# EAGLE design habanero-32m (EAGLE 6.4)
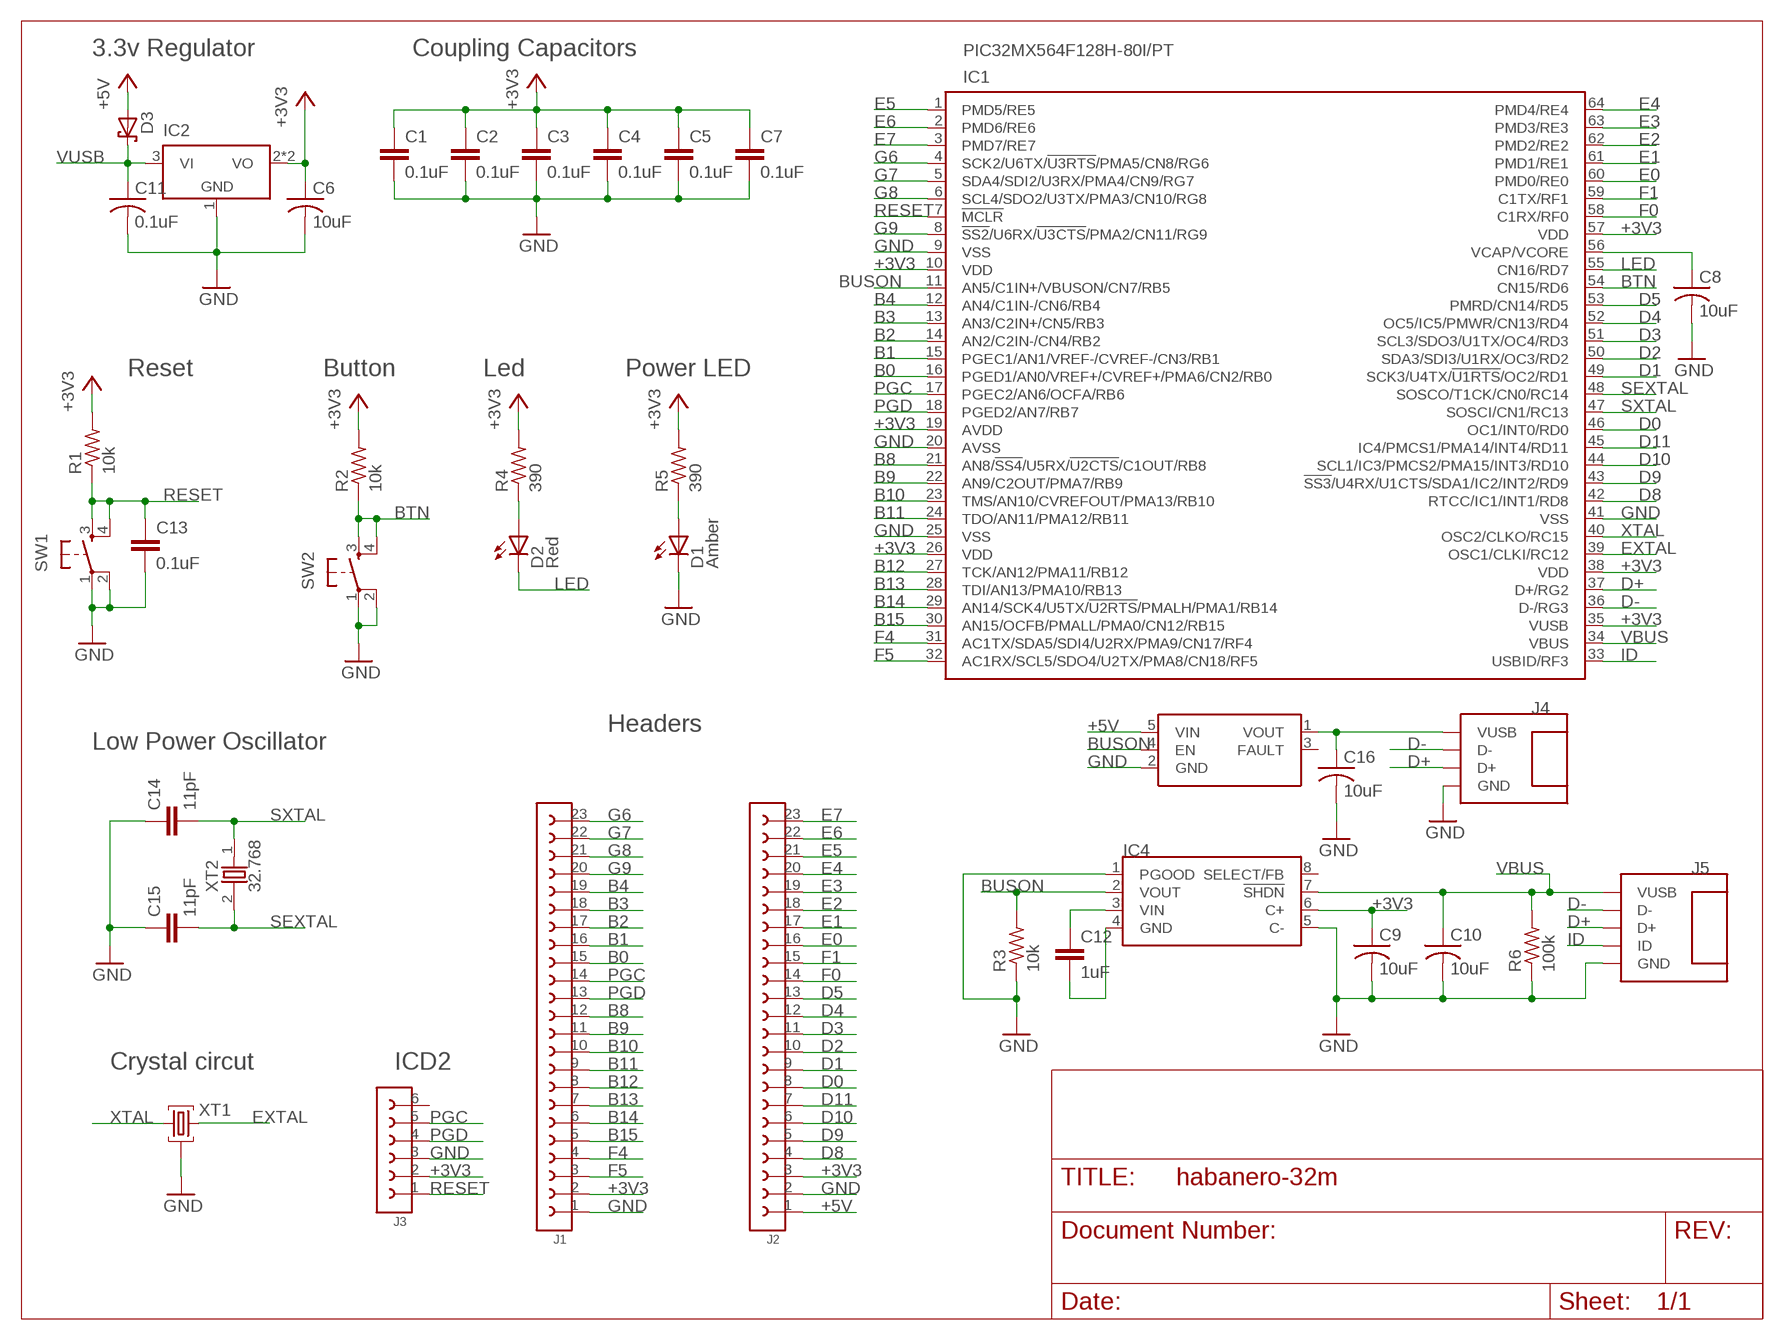
[diagram p0: schematic, sheet 1]

## Parts
C1  0.1uF  C0603C104Z3VAC  [CAPC0603]
C2  0.1uF  C0603C104Z3VAC  [CAPC0603]
C3  0.1uF  C0603C104Z3VAC  [CAPC0603]
C4  0.1uF  C0603C104Z3VAC  [CAPC0603]
C5  0.1uF  C0603C104Z3VAC  [CAPC0603]
C6  10uF  T491A106K016AT  [CAPMP3216-18]
C7  0.1uF  C0603C104Z3VAC  [CAPC0603]
C8  10uF  T491A106K016AT  [CAPMP3216-18]
C9  10uF  T491A106K016AT  [CAPMP3216-18]
C10  10uF  T491A106K016AT  [CAPMP3216-18]
C11  0.1uF  T491A104K050AT  [CAPMP3216-18]
C12  1uF  C0805C105K4RAC  [CAPC0805]
C13  0.1uF  C0603C104Z3VAC  [CAPC0603]
C14  11pF  C0603C110J5GAC  [CAPC0603]
C15  11pF  C0603C110J5GAC  [CAPC0603]
C16  10uF  T491A106K016AT  [CAPMP3216-18]
D1  Amber  SM0805AC  [D0805]
D2  Red  SM0805HC  [D0805]
D3  MBR0530T1G  [SOT123160X270-2N]
IC1  PIC32MX564F128H-80I/PT  [QFP50P1200X1200X100-64N]
IC2  LD1117S33TR  [SOT230P700X180-4N]
IC3  SMTPS2141STR  [SOT95P280X100-5M]
IC4  MCP1253-33X50I/MS  [SOP65P490X109-8M]
J1  61302311121  [PHSP254P5842X254X1154-23S]
J2  61302311121  [PHSP254P5842X254X1154-23S]
J3  61300611121  [PHSP254P1524X254X1154-6S]
J4  292303-1  [USB-A]
J5  1981584-1  [USB-MICRO-B]
R1  10k  CRG0603F10K10  [RESC0603]
R2  10k  CRG0603F10K10  [RESC0603]
R3  10k  CRG0603F10K10  [RESC0603]
R4  390  CRG0603F390R  [RESC0603]
R5  390  CRG0603F390R  [RESC0603]
R6  100k  CRG0603F100K  [RESC0603]
SW1  TL3301NF160QJ  [TACT600X600-4J]
SW2  TL3301NF160QJ  [TACT600X600-4J]
XT1  AWSCR-12.00CR-C  [CERAMIC460X200-3N]
XT2  32.768  ABS07-120-32.768KHZ-T  [CEMIC320X150-2N]

## Nets
+3V3: C1.1 C2.1 C3.1 C4.1 C5.1 C6.1 C7.1 C9.1 IC1.10(VDD) IC1.19(AVDD) IC1.26(VDD) IC1.35(VUSB) IC1.38(VDD) IC1.57(VDD) IC2.2(VO) IC2.4(VO) IC4.6(C+) J1.2 J2.3 J3.2 R1.P$2 R2.P$2 R4.P$2 R5.P$2
+5V: D3.1(A) IC3.5(VIN) J2.1
B0: IC1.16(PGED1/AN0/VREF+/CVREF+/PMA6/CN2/RB0) J1.15
B1: IC1.15(PGEC1/AN1/VREF-/CVREF-/CN3/RB1) J1.16
B2: IC1.14(AN2/C2IN-/CN4/RB2) J1.17
B3: IC1.13(AN3/C2IN+/CN5/RB3) J1.18
B4: IC1.12(AN4/C1IN-/CN6/RB4) J1.19
B8: IC1.21(AN8/!SS4!/U5RX/!U2CTS!/C1OUT/RB8) J1.12
B9: IC1.22(AN9/C2OUT/PMA7/RB9) J1.11
B10: IC1.23(TMS/AN10/CVREFOUT/PMA13/RB10) J1.10
B11: IC1.24(TDO/AN11/PMA12/RB11) J1.9
B12: IC1.27(TCK/AN12/PMA11/RB12) J1.8
B13: IC1.28(TDI/AN13/PMA10/RB13) J1.7
B14: IC1.29(AN14/SCK4/U5TX/!U2RTS!/PMALH/PMA1/RB14) J1.6
B15: IC1.30(AN15/OCFB/PMALL/PMA0/CN12/RB15) J1.5
BTN: IC1.54(CN15/RD6) R2.P$1 SW2.3(S) SW2.4(S1)
BUSON: IC1.11(AN5/C1IN+/VBUSON/CN7/RB5) IC3.4(EN) IC4.2(VOUT) R3.P$2
D0: IC1.46(OC1/INT0/RD0) J2.8
D1: IC1.49(SCK3/U4TX/!U1RTS!/OC2/RD1) J2.9
D2: IC1.50(SDA3/SDI3/U1RX/OC3/RD2) J2.10
D3: IC1.51(SCL3/SDO3/U1TX/OC4/RD3) J2.11
D4: IC1.52(OC5/IC5/PMWR/CN13/RD4) J2.12
D5: IC1.53(PMRD/CN14/RD5) J2.13
D8: IC1.42(RTCC/IC1/INT1/RD8) J2.4
D9: IC1.43(!SS3!/U4RX/U1CTS/SDA1/IC2/INT2/RD9) J2.5
D10: IC1.44(SCL1/IC3/PMCS2/PMA15/INT3/RD10) J2.6
D11: IC1.45(IC4/PMCS1/PMA14/INT4/RD11) J2.7
D+: IC1.37(D+/RG2) J4.2(D+) J5.3(D+)
D-: IC1.36(D-/RG3) J4.3(D-) J5.2(D-)
E0: IC1.60(PMD0/RE0) J2.16
E1: IC1.61(PMD1/RE1) J2.17
E2: IC1.62(PMD2/RE2) J2.18
E3: IC1.63(PMD3/RE3) J2.19
E4: IC1.64(PMD4/RE4) J2.20
E5: IC1.1(PMD5/RE5) J2.21
E6: IC1.2(PMD6/RE6) J2.22
E7: IC1.3(PMD7/RE7) J2.23
EXTAL: IC1.39(OSC1/CLKI/RC12) XT1.3
F0: IC1.58(C1RX/RF0) J2.14
F1: IC1.59(C1TX/RF1) J2.15
F4: IC1.31(AC1TX/SDA5/SDI4/U2RX/PMA9/CN17/RF4) J1.4
F5: IC1.32(AC1RX/SCL5/SDO4/U2TX/PMA8/CN18/RF5) J1.3
G6: IC1.4(SCK2/U6TX/!U3RTS!/PMA5/CN8/RG6) J1.23
G7: IC1.5(SDA4/SDI2/U3RX/PMA4/CN9/RG7) J1.22
G8: IC1.6(SCL4/SDO2/U3TX/PMA3/CN10/RG8) J1.21
G9: IC1.8(!SS2!/U6RX/!U3CTS!/PMA2/CN11/RG9) J1.20
GND: C1.2 C2.2 C3.2 C4.2 C5.2 C6.2 C7.2 C8.2 C9.2 C10.2 C11.2 C13.2 C14.1 C15.1 C16.2 D1.2(C) IC1.9(VSS) IC1.20(AVSS) IC1.25(VSS) IC1.41(VSS) IC2.1(GND) IC3.2(GND) IC4.1(PGOOD) IC4.5(C-) J1.1 J2.2 J3.3 J4.4(GND) J5.5(GND) R3.P$1 R6.P$1 SW1.1(P) SW1.2(P1) SW2.1(P) SW2.2(P1) XT1.2
ID: IC1.33(USBID/RF3) J5.4(ID)
LED: D2.2(C) IC1.55(CN16/RD7)
N$6: C16.1 IC3.1(VOUT) J4.1(VUSB)
N$8: C12.1 IC4.3(VIN)
N$9: D1.1(A) R5.P$1
N$10: D2.1(A) R4.P$1
N$11: C12.2 IC4.4(GND)
N$16: C8.1 IC1.56(VCAP/VCORE)
PGC: IC1.17(PGEC2/AN6/OCFA/RB6) J1.14 J3.5
PGD: IC1.18(PGED2/AN7/RB7) J1.13 J3.4
RESET: C13.1 IC1.7(!MCLR) J3.1 R1.P$1 SW1.3(S) SW1.4(S1)
SEXTAL: C15.2 IC1.48(SOSCO/T1CK/CN0/RC14) XT2.2
SXTAL: C14.2 IC1.47(SOSCI/CN1/RC13) XT2.1
VBUS: C10.1 IC1.34(VBUS) IC4.7(!SHDN) J5.1(VUSB) R6.P$2
VUSB: C11.1 D3.2(C) IC2.3(VI)
XTAL: IC1.40(OSC2/CLKO/RC15) XT1.1
Unconnected: IC3.3(FAULT) IC4.8(SELECT/FB) J3.6

## Notes on the sheet
- 3.3v Regulator | Coupling Capacitors
- Reset | Button | Led | Power LED
- Headers
- Low Power Oscillator
- Crystal circut | ICD2

## Library data of the parts
C1-C5 C7 C13 = kemet-capacitors-ceramic:C?C*VAC: Y5V Dielectric, 6.3 – 50 VDC (Commercial Grade) Description OVERVIEW: KEMET’s Y5V dielectric features an 85°C maximum operating temperature and is considered “general-purpose.” The Electronics Components, Assemblies & Materials Association (EIA) characterizes Z5U dielectric as a Class III material. Components of this classiﬁ cation are ﬁ xed, ceramic dielectric capacitors suited for bypass and decoupling or other applications in which dielectric losses, high insulation resistance and capacitance stability are not of major importance. Y5V exhibits a predictable change in capacitance with respect to time and voltage and displays wide variations in capacitance with reference to ambient temperature. Capacitance change is limited to +22%, -82% from -30°C to +85°C. APPLICATIONS: Typical applications include limited temperature, decoupling and bypass. BENEFITS • -30°C to +85°C operating temperature range • Pb-Free and RoHS Compliant • EIA 0402, 0603, 0805, 1206, and 1210 case sizes • DC voltage ratings of 6.3 V, 10 V, 16 V, 25 V, and 50 V • Capacitance offerings ranging from 0.022 μF to 22 μF • Available capacitance tolerance of +80%/ -20% • Non-polar device, minimizing installation concerns • 100% pure matte tin-plated termination ﬁ nish that allowing for excellent solderability How to Order C 1210 C 226 Z 4 V A C TU Capacitor Class Case Size Specification Series Capacitance Code (pF) Capacitance Tolerance Voltage Dielectric Failure Rate/Design Termination Finish Packaging Grade C = Ceramic 0402 0603 0805 1206 1210 C = Standart 2 signiﬁ cant digits + number of zeros. Use 9 for 1.0 – 9.9 pF Use 8 for 0.5 – .99 pF e.g., 2.2 pF = 229 e.g., 0.5 pF = 508 Z = +80%/-20% 9 = 6.3V 8 = 10V 4 = 16V 3 = 25V 5 = 50 V V = Y5V A = N/A A = 100% Matte Blank = Bulk TU = 7" Reel Unmarked. Ref: Datasheet <http://www.kemet.com/kemet/web/homepage/kechome.nsf/weben/B79D94FAACCDEFCE852579F10063745E/$file/KEM_CC101_COMM_SMD.pdf> Add more variants to C@VAC, just remplace the "@" with a new technologie named according to order code parameters. It is mandatory to fill up the following attributes MANUFACTURER, DESCRIPTION, MOUSER, AVNET, ARROW, FUTURE, NEWARK, DIGIKEY, AVRG-PRICE, OCTOPART-LINK, DATASHEET; AVNET: C0603C104Z3VAC TU; AVRG-PRICE: 0.1; DATASHEET: http://www.kemet.com/kemet/web/homepage/kechome.nsf/weben/B79D94FAACCDEFCE852579F10063745E/$file/KEM_CC101_COMM_SMD.pdf; DESCRIPTION: Capacitores cerámicos de capas múltiples (MLCC) - SMD/SMT0603 25volts 0.1uF Y5V -20+80%; DIGIKEY: 399-1100-2-ND; EAGLEUP: CAPC0603; MANUFACTURER: KEMET; MOUSER: 80-C0603C104Z3V; NEWARK: 31C9013; OCTOPART-LINK: http://octopart.com/c0603c104z3vactu-kemet-98662
C6 C8-C10 C16 = kemet-capacitors-tantalum:T491?*: T491 Industrial Grade MnO2 Series Description OVERVIEW The KEMET T491 Series, designed speciﬁ cally for today’s highly automated surface mount processes and equipment, is the leading choice for surface mount designs. The T491 combines KEMET’s proven solid tantalum technology, acclaimed and respected throughout the world, with the latest in materials, processes and automation, resulting in unsurpassed total performance and value APPLICATIONS Typical applications include decoupling and ﬁ ltering in industrial and automotive end applications such as DC/DC converters, portable electronics, telecommunications, and control units. BENEFITS: • Taped and reeled per EIA 481–1 • Symmetrical, compliant terminations • Optical gold-plated terminations • Laser-marked case • 100% surge current test on C, D, E, U, V, X sizes • Halogen free epoxy • Capacitance 0.1 µF to 1,000 µF • Tolerance ±10%, ±20% • Voltage 2.5 – 50 VDC • Extended range values • Low proﬁ le case sizes • RoHS Compliant and lead-free terminations (See www.kemet.com for transition information) • Operating temperature: -55ºC to +125ºC How to Order T 491 X 157 K 020 A T Capacitor Class Series Case Size Capacitance Code (pF) Capacitance Tolerance Voltage Failure Rate/ Design Lead Material Packaging (C-Spec) T = Tantalum Industrial A, B, C, D, E, R, S, T, U, V, X First two digits represent signiﬁ cant ﬁgures. Third digit speciﬁ es number of zeros. K = ±10% M = ±20% 2R5 = 2.5 V 003 = 3 V 004 = 4 V 006 = 6.3 V 010 = 10 V 016 = 16 V 020 = 20 V 025 = 25 V 035 = 35 V 050 = 50 V A = N/A T = 100% Matte Tin (Sn) Plated* H = Standard Solder Coated (SnPb 5% Pb minimum) G = Gold Plated (A, B, C, D, X only) N = Non-Magnetic 100% Tin (Sn) M = Non-Magnetic (SnPb) Blank = 7" Reel 7280 = 13" Ree Ref: Datasheet <http://www.kemet.com/kemet/web/homepage/kechome.nsf/weben/9F2DE33590D9247E8525788D0059B1E1/$file/KEM_TC101_STD.pdf> Add more variants to T491@, just remplace the "@" with a new technologie named according to order code parameters. It is mandatory to fill up the following attributes MANUFACTURER, DESCRIPTION, MOUSER, AVNET, ARROW, FUTURE, NEWARK, DIGIKEY, AVRG-PRICE, OCTOPART-LINK, DATASHEET; AVRG-PRICE: 0.18; DATASHEET: http://www.kemet.com/kemet/web/homepage/kechome.nsf/weben/9F2DE33590D9247E8525788D0059B1E1/$file/KEM_TC101_STD.pdf; DESCRIPTION: Capacitores de tantalio - SMD sólido 16volt 10uF 10% Lead Free; DIGIKEY: 399-8269-2-ND; EAGLEUP: CAPMP3216-18; MANUFACTURER: KEMET; MOUSER: 80-T491A106K016; OCTOPART-LINK: http://octopart.com/t491a106k016at-kemet-145880
C11 = kemet-capacitors-tantalum:T491?*: T491 Industrial Grade MnO2 Series Description OVERVIEW The KEMET T491 Series, designed speciﬁ cally for today’s highly automated surface mount processes and equipment, is the leading choice for surface mount designs. The T491 combines KEMET’s proven solid tantalum technology, acclaimed and respected throughout the world, with the latest in materials, processes and automation, resulting in unsurpassed total performance and value APPLICATIONS Typical applications include decoupling and ﬁ ltering in industrial and automotive end applications such as DC/DC converters, portable electronics, telecommunications, and control units. BENEFITS: • Taped and reeled per EIA 481–1 • Symmetrical, compliant terminations • Optical gold-plated terminations • Laser-marked case • 100% surge current test on C, D, E, U, V, X sizes • Halogen free epoxy • Capacitance 0.1 µF to 1,000 µF • Tolerance ±10%, ±20% • Voltage 2.5 – 50 VDC • Extended range values • Low proﬁ le case sizes • RoHS Compliant and lead-free terminations (See www.kemet.com for transition information) • Operating temperature: -55ºC to +125ºC How to Order T 491 X 157 K 020 A T Capacitor Class Series Case Size Capacitance Code (pF) Capacitance Tolerance Voltage Failure Rate/ Design Lead Material Packaging (C-Spec) T = Tantalum Industrial A, B, C, D, E, R, S, T, U, V, X First two digits represent signiﬁ cant ﬁgures. Third digit speciﬁ es number of zeros. K = ±10% M = ±20% 2R5 = 2.5 V 003 = 3 V 004 = 4 V 006 = 6.3 V 010 = 10 V 016 = 16 V 020 = 20 V 025 = 25 V 035 = 35 V 050 = 50 V A = N/A T = 100% Matte Tin (Sn) Plated* H = Standard Solder Coated (SnPb 5% Pb minimum) G = Gold Plated (A, B, C, D, X only) N = Non-Magnetic 100% Tin (Sn) M = Non-Magnetic (SnPb) Blank = 7" Reel 7280 = 13" Ree Ref: Datasheet <http://www.kemet.com/kemet/web/homepage/kechome.nsf/weben/9F2DE33590D9247E8525788D0059B1E1/$file/KEM_TC101_STD.pdf> Add more variants to T491@, just remplace the "@" with a new technologie named according to order code parameters. It is mandatory to fill up the following attributes MANUFACTURER, DESCRIPTION, MOUSER, AVNET, ARROW, FUTURE, NEWARK, DIGIKEY, AVRG-PRICE, OCTOPART-LINK, DATASHEET; AVRG-PRICE: 0.23; DATASHEET: http://www.kemet.com/kemet/web/homepage/kechome.nsf/weben/9F2DE33590D9247E8525788D0059B1E1/$file/KEM_TC101_STD.pdf; DESCRIPTION: Capacitores de tantalio - SMD sólido 50V 0.1uF 10% "A"; DIGIKEY: 399-8263-2-ND; EAGLEUP: CAPMP3216-18; MANUFACTURER: KEMET; MOUSER: 80-T491A104K050; NEWARK: 57K1620; OCTOPART-LINK: http://octopart.com/t491a104k050at-kemet-104789
C12 = kemet-capacitors-ceramic:C?C*RAC: X7R Dielectric, 6.3 – 250 VDC (Commercial Grade) Description OVERVIEW: KEMET’s X7R dielectric features a 125°C maximum operating temperature and is considered “temperature stable.” The Electronics Components, Assemblies & Materials Association (EIA) characterizes X7R dielectric as a Class II material. Components of this classiﬁ cation are ﬁ xed, ceramic dielectric capacitors suited for bypass and decoupling applications or for frequency discriminating circuits where Q and stability of capacitance characteristics are not critical. X7R exhibits a predictable change in capacitance with respect to time and voltage and boasts a minimal change in capacitance with reference to ambient temperature. Capacitance change is limited to ±15% from -55°C to +125°C. APPLICATIONS: Typical applications include decoupling, bypass, ﬁ ltering and transient voltage suppression. BENEFITS • -55°C to +125°C operating temperature range • Pb-Free and RoHS Compliant • Temperature stable dielectric • EIA 0402, 0603, 0805, 1206, 1210, 1808, 1812, 1825, 2220, and 2225 case sizes • DC voltage ratings of 6.3 V, 10 V, 16 V, 25 V, 50 V, 100 V, 200 V, and 250 V • Capacitance offerings ranging from 10 pF to 47 μF • Available capacitance tolerances of ±5%, ±10%, and ±20% • Non-polar device, minimizing installation concerns • 100% pure matte tin-plated termination ﬁ nish allowing for excellent solderability • SnPb termination ﬁ nish option available upon request (5% minimum) How to Order C 1206 C 106 M 4 R A C TU Capacitor Class Case Size Specification Series Capacitance Code (pF) Capacitance Tolerance Voltage Dielectric Failure Rate/Design Termination Finish Packaging Grade C = Ceramic 0402 0603 0805 1206 1210 1808 1812 1825 2220 2225 C = Standart 2 signiﬁ cant digits + number of zeros. Use 9 for 1.0 – 9.9 pF Use 8 for 0.5 – .99 pF e.g., 2.2 pF = 229 e.g., 0.5 pF = 508 J = ±5% K = ±10% M = ±20% 9 = 6.3 V 8 = 10 V 4 = 16 V 3 = 25 V 5 = 50 V 1 = 100 V 2 = 200 V A = 250 V R = X7R A = N/A A = 100% Matte Blank = Bulk TU = 7" Reel Unmarked. Ref: Datasheet <http://www.kemet.com/kemet/web/homepage/kechome.nsf/weben/B79D94FAACCDEFCE852579F10063745E/$file/KEM_CC101_COMM_SMD.pdf> Add more variants to C@RAC, just remplace the "@" with a new technologie named according to order code parameters. It is mandatory to fill up the following attributes MANUFACTURER, DESCRIPTION, MOUSER, AVNET, ARROW, FUTURE, NEWARK, DIGIKEY, AVRG-PRICE, OCTOPART-LINK, DATASHEET; EAGLEUP: CAPC0805
C14 C15 = kemet-capacitors-ceramic:C?C*GAC: COG Dielectric, 10 – 200 VDC (Commercial Grade) Description OVERVIEW: KEMET’s C0G dielectric features a 125°C maximum operating temperature and is considered “stable.” The Electronics Components, Assemblies & Materials Association (EIA) characterizes C0G dielectric as a Class I material. Components of this classiﬁ cation are temperature compensating and are suited for resonant circuit applications or those where Q and stability of capacitance characteristics are required. C0G exhibits no change in capacitance with respect to time and voltage and boasts a negligible change in capacitance with reference to ambient temperature. Capacitance change is limited to ±30 ppm/ºC from -55°C to +125°C. BENEFITS • -55°C to +125°C operating temperature range • RoHS Compliant • EIA 0201, 0402, 0603, 0805, 1206, 1210, 1808, 1812, 1825, 2220, and 2225 case sizes • DC voltage ratings of 10 V, 16 V, 25 V, 50 V, 100 V, and 200 V • Capacitance offerings ranging from 0.5 pF up to 0.47 μF • Available capacitance tolerances of ±0.10 pF, ±0.25 pF, ±0.5 pF, ±1%, ±2%, ±5%, ±10%, and ±20% • No piezoelectric noise • Extremely low ESR and ESL • High thermal stability • High ripple current capability • Preferred capacitance solution at line frequencies and into the MHz range • No capacitance change with respect to applied rated DC voltage • Negligible capacitance change with respect to temperature from -55°C to +125°C • No capacitance decay with time • Non-polar device, minimizing installation concerns • 100% pure matte tin-plated termination ﬁ nish allowing for excellent solderability • SnPb plated termination ﬁ nish option available upon request (5% minimum) How to Order C 1206 C 104 J 3 G A C TU Capacitor Class Case Size Specification Series Capacitance Code (pF) Capacitance Tolerance Voltage Dielectric Failure Rate/Design Termination Finish Packaging Grade C = Ceramic 0201 0402 0603 0805 1206 1210 1808 1812 1825 2220 2225 C = Standart 2 signiﬁ cant digits + number of zeros. Use 9 for 1.0 – 9.9 pF Use 8 for 0.5 – .99 pF e.g., 2.2 pF = 229 e.g., 0.5 pF = 508 B = ±0.10 pF C = ±0.25 pF D = ±0.5 pF F = ±1% G = ±2% J = ±5% K = ±10% M = ±20% 8 = 10 V 4 = 16 V 3 = 25 V 5 = 50 V 1 = 100 V 2 = 200 V C = COG A = N/A A = 100% Matte Blank = Bulk TU = 7" Reel Unmarked. Ref: Datasheet <http://www.kemet.com/kemet/web/homepage/kechome.nsf/weben/B79D94FAACCDEFCE852579F10063745E/$file/KEM_CC101_COMM_SMD.pdf> Add more variants to C@GAC, just remplace the "@" with a new technologie named according to order code parameters. It is mandatory to fill up the following attributes MANUFACTURER, DESCRIPTION, MOUSER, AVNET, ARROW, FUTURE, NEWARK, DIGIKEY, AVRG-PRICE, OCTOPART-LINK, DATASHEET; AVRG-PRICE: 0.1; DATASHEET: http://www.kemet.com/kemet/web/homepage/kechome.nsf/weben/B79D94FAACCDEFCE852579F10063745E/$file/KEM_CC101_COMM_SMD.pdf; DESCRIPTION: Capacitores cerámicos de capas múltiples (MLCC) - SMD/SMT 50volts 11pF C0G 5%; DIGIKEY: C0603C110J5GACTU-ND; EAGLEUP: CAPC0603; MANUFACTURER: KEMET; MOUSER: 80-C0603C110J5G; NEWARK: 29T8977; OCTOPART-LINK: http://octopart.com/c0603c110j5gactu-kemet-9138569
D1 = bivar-smleds:SM0805*: Surface Mount LED 0805 Description Bivar Surface Mount 0805 package LED may be used in nearly any lighting or indication application. The miniature package is ideal for small scale applications such as general indication and backlighting. Low power consumption and excellent long life reliability are suitable for battery powered equipment. Bivar offers water clear LED lens for maximum luminous intensity. Wide variety of wavelength and intensity combinations are available to meet any illumination need. The SM0805 LED is packaged in standard tape and reels for pick and place assemblies. ♦ Industry Standard 0805 Package ♦ RoHS Compliant ♦ Small Package and Footprint ♦ Water Clear Lens ♦ Wide Viewing Angle ♦ Ideal for Status Indication, Display, and Backlighting How to Order Type Package Color Clear type Current level SM = Surface mount 0805 A = Amber BW = Blue G = Green H = HE red O = Orange PG = Pure Green R = Read SB = Super Blue SG = Super Green SPG = Super Pure Green SR = Super Red UBW = Ultra Blue UH = Ultra HE Red UO = Ultra Orange UPG = Ultra Pure Green UR = Ultra Red UW = Ultra White UY = Ultra Yellow XPG = Xtra Pure Green Y = Yellow C = Water Clear None = standart L = Low Current Ref: Link <http://www.bivar.com/Products/LEDIndication/LEDs/SurfaceMountLEDs.aspx> Add more variants to SM0805@, just remplace the "@" with a new technologie named according to order code parameters. It is mandatory to fill up the following attributes DESCRIPTION, MOUSER, AVNET, ARROW, FUTURE, NEWARK, DIGIKEY, AVRG-PRICE, OCTOPART-LINK, DATASHEET; AVRG-PRICE: 0.4; DATASHEET: http://www.bivar.com/Images/Cart/SM0805AC.pdf; DESCRIPTION: LED, SMD, 0805, 2 Leads, Amber, Water Clear Lens, 130 Deg Viewing Angle; DIGIKEY: SM0805AC-ND; EAGLEUP: D0805; MOUSER: 749-SM0805AC; NEWARK: 20K3100; OCTOPART-LINK: http://octopart.com/sm0805ac-bivar-5838577
D2 = bivar-smleds:SM0805*: Surface Mount LED 0805 Description Bivar Surface Mount 0805 package LED may be used in nearly any lighting or indication application. The miniature package is ideal for small scale applications such as general indication and backlighting. Low power consumption and excellent long life reliability are suitable for battery powered equipment. Bivar offers water clear LED lens for maximum luminous intensity. Wide variety of wavelength and intensity combinations are available to meet any illumination need. The SM0805 LED is packaged in standard tape and reels for pick and place assemblies. ♦ Industry Standard 0805 Package ♦ RoHS Compliant ♦ Small Package and Footprint ♦ Water Clear Lens ♦ Wide Viewing Angle ♦ Ideal for Status Indication, Display, and Backlighting How to Order Type Package Color Clear type Current level SM = Surface mount 0805 A = Amber BW = Blue G = Green H = HE red O = Orange PG = Pure Green R = Read SB = Super Blue SG = Super Green SPG = Super Pure Green SR = Super Red UBW = Ultra Blue UH = Ultra HE Red UO = Ultra Orange UPG = Ultra Pure Green UR = Ultra Red UW = Ultra White UY = Ultra Yellow XPG = Xtra Pure Green Y = Yellow C = Water Clear None = standart L = Low Current Ref: Link <http://www.bivar.com/Products/LEDIndication/LEDs/SurfaceMountLEDs.aspx> Add more variants to SM0805@, just remplace the "@" with a new technologie named according to order code parameters. It is mandatory to fill up the following attributes DESCRIPTION, MOUSER, AVNET, ARROW, FUTURE, NEWARK, DIGIKEY, AVRG-PRICE, OCTOPART-LINK, DATASHEET; AVRG-PRICE: 0.4; DATASHEET: http://www.bivar.com/images/cart/SM0805HC.pdf; DESCRIPTION: LED estándar - SMD (montaje superficial) HE Red 660 nm Water Clear; DIGIKEY: SM0805HC-ND; EAGLEUP: D0805; MOUSER: 749-SM0805HC; OCTOPART-LINK: http://octopart.com/sm0805hc-bivar-2191580
D3 = on-diodes:MBR0530T*G: SCHOTTKY BARRIER RECTIFIER 0.5 AMPERES 30 VOLTS Description The MBR0530T1/3 uses the Schottky Barrier principle with a large area metal−to−silicon power diode. Ideally suited for low voltage, high frequency rectification or as free wheeling and polarity protection diodes in surface mount applications where compact size and weight are critical to the system. This package also provides an easy to work with alternative to leadless 34 package style. These state−of−the−art devices have the following features: Features  Guardring for Stress Protection  Low Forward Voltage  125C Operating Junction Temperature  Epoxy Meets UL 94, V−0 @ 0.125 in  Package Designed for Optimal Automated Board Assembly  AEC−Q101 Qualified and PPAP Capable  NRVB Prefix for Automotive and Other Applications Requiring Unique Site and Control Change Requirements  All Packages are Pb−Free* How to Order Ref: Datasheet <http://www.mouser.com/ds/2/308/MBR0530T1-D-109532.pdf> Add more variants to MBR0530T@G, just remplace the "@" with a new technologie named according to order code parameters. It is mandatory to fill up the following attributes DESCRIPTION, MOUSER, AVNET, ARROW, FUTURE, NEWARK, DIGIKEY, AVRG-PRICE, OCTOPART-LINK, DATASHEET; EAGLEUP: SOD123
IC1 = mchp_pic32:PIC32MX5*H?: 64 pins, USB and CAN Microcontroller, from 64k to 512k and 32k/128k Ram Description PIC32MX564F064H (64k Flash, 32k Ram) PIC32MX564F128H (128k Flash, 32k Ram) PIC32MX575F256H (256k Flash, 64k Ram) PIC32MX575F512H (512k Flash, 64k Ram) PIC32MX595F512H (512k Flash, 128k Ram) MCU Core -80MHz, 1.56 DMIPS/MHz, 32-bit MIPS M4K® Core -USB 2.0 On-The-Go Peripheral with integrated PHY -10/100 Ethernet MAC with MII/RMII Interfaces -2 x CAN2.0b modules with 1024 buffers -8 Dedicated DMA Channels for USB OTG, Ethernet, and CAN -5 Stage pipeline, Harvard architecture -MIPS16e mode for up to 40% smaller code size -Single cycle multiply and hardware divide unit -32 x 32-bit Core Registers -32 x 32-bit Shadow Registers -Fast context switch and interrupt response MCU System Features -512K Flash (plus 12K boot Flash) -128K RAM (can execute from RAM) -8 Channel General Hardware DMA Controller -Flash prefetch module with 256 Byte cache -Lock instructions or data in cache for fast access -Programmable vector interrupt controller Analog Features -Fast and Accurate 16 channel 10-bit ADC, Max 1 Mega sample per second at +/- 1LSB, conversion available during SLEEP & IDLE -Power Management Modes -RUN, IDLE, and SLEEP modes -Multiple switchable clock modes for each power mode, enables optimum power settings Debug Features -iFlow Trace: Non-intrusive Hardware Instruction Trace port (5 Wires) -8 hardware breakpoints (6 Instruction and 2 Data) -2 wire programming and debugging interface -JTAG interface supporting Programming, Debugging and Boundary scan Other MCU Features -Fail-Safe Clock Monitor - allows safe shutdown if clock fails -2 Internal oscillators (8MHz & 31KHz) -Hardware RTCC (Real-Time Clock and Calendar with Alarms) -Watchdog Timer with separate RC oscillator -Pin compatible with 16-bit PIC® MCUs -Serial Communication Modules allow flexible UART/SPI/I2C™ configuration Device Program Data USB CAN Timers/ Capture/ Compare DMA Channels UART SPI I2C ADC channels Comparators PMP/PSP Jtag Trace PIC32MX564F064H 64 32 1 1 5/5/5 4/4 6 3 4 16 2 Yes Yes No PIC32MX564F128H 128 32 1 1 5/5/5 4/4 6 3 4 16 2 Yes Yes No PIC32MX575F256H 256 64 1 1 5/5/5 8/4 6 3 4 16 2 Yes Yes No PIC32MX575F512H 256 64 1 1 5/5/5 8/4 6 3 4 16 2 Yes Yes No PIC32MX595F512H 512 128 1 1 5/5/5 8/4 6 3 4 16 2 Yes Yes No Ref: Datasheet <http://ww1.microchip.com/downloads/en/DeviceDoc/61156G.pdf>
IC2 = st-ldos:LD1117?*: Low Drop Adjustable Positive Voltage Regulator Description The LD1117 is a low drop voltage regulator able to provide up to 800 mA of output current, available even in adjustable version (VREF= 1.25 V). Concerning fixed versions, are offered the following output voltages: 1.2 V, 1.8 V, 2.5 V, 2.85 V, 3.3 V and 5.0 V. The 2.85 V type is ideal for SCSI-2 lines active termination. The device is supplied in: SOT-223, DPAK, SO-8 and TO-220. The SOT-223 and DPAK surface mount packages optimize the thermal characteristics even offering a relevant space saving effect. High efficiency is assured by NPN pass transistor. In fact in this case, unlike than PNP one, the quiescent current flows mostly into the load. Only a very common 10 μF minimum capacitor is needed for stability. On chip trimming allows the regulator to reach a very tight output voltage tolerance, within ± 1 % at 25 °C. The adjustable LD1117 is pin to pin compatible with the other standard. Adjustable voltage regulators maintaining the better performances in terms of drop and tolerance. KEY FEATURES Low dropout voltage (1 V typ.) 2.85 V device performances are suitable for SCSI-2 active termination Output current up to 800 mA Fixed output voltage of: 1.2 V, 1.8 V, 2.5 V, 3.3 V, 5.0 V Adjustable version availability (VREF= 1.25 V) Internal current and thermal limit Available in ± 1 % (at 25 °C) and 2 % in full temperature range Supply voltage rejection: 75 dB (typ.) How To Order Part Number Package Output Voltaje Temp Range LD1117 S = SOT-223 D = SOIC8 DT = DPACK V = TO220 None = Adjustable 12 = 1.2 volts 18 = 1.8 volts 25 = 2.5 volts 33 = 3.3 volts 50 = 5.0 volts None = 0 to 125 C C = -40 to 125 C Ref: Datasheet <http://www.st.com/internet/com/TECHNICAL_RESOURCES/TECHNICAL_LITERATURE/DATASHEET/CD00000544.pdf> Add more variants to LD1117@, just remplace the "@" with a new technologie named according to order code parameters. It is mandatory to fill up the following attributes MANUFACTURER, DESCRIPTION, MOUSER, AVNET, ARROW, FUTURE, NEWARK, DIGIKEY, AVRG-PRICE, OCTOPART-LINK, DATASHEET; ARROW: LD1117S33TR; AVNET: LD1117S33TR; AVRG-PRICE: 0.76; DATASHEET: http://www.st.com/internet/com/TECHNICAL_RESOURCES/TECHNICAL_LITERATURE/DATASHEET/CD00000544.pdf; DESCRIPTION: Reguladores de interrupción de nivel bajo - LDO 3.3V 0.8A Positive; DIGIKEY: 497-1242-2-ND; EAGLEUP: SOT230P700X180-4N; FUTURE: LD1117S33TR; MANUFACTURER: ST; MOUSER: 511-LD1117S33; NEWARK: 89K0627; OCTOPART-LINK: http://octopart.com/ld1117s33tr-stmicroelectronics-526708
IC3 = st-power-sw:SMTPS21*?TR: Enhanced single channel power switches Description The STMPS2141, STMPS2151, STMPS2161, STMPS2171 power distribution switches are intended for applications where heavy capacitive loads and short circuits are likely to be encountered. These devices incorporate 90 mΩ N-channel MOSFET high-side power switches for power-distribution. These switches are controlled by a logic enable input. KEY FEATURES ■ 90 mΩ high-side MOSFET switch ■ 500/1000 mA continuous current ■ Thermal and short-circuit protection with overcurrent logic output ■ Operating range from 2.7 V to 5.5 V ■ CMOS- and TTL-compatible enable inputs ■ Undervoltage lockout (UVLO) ■ 12 µA maximum standby supply current ■ Ambient temperature range, -40°C to 85°C ■ 8 kV ESD protection ■ Reverse current protection ■ Fault-blanking How To Order Part Number Current Enable Package STMPS21 41 = 500mA 51 = 500mA 61 = 1000mA 71 = 1000mA Active low Active high Active low Active high M = SOIC-8 S= SOT23-5L T = TSSOP8 Ref: Datasheet <http://www.st.com/st-web-ui/static/active/en/resource/technical/document/datasheet/CD00167470.pdf> Add more variants to STMPS21@, just remplace the "@" with a new technologie named according to order code parameters. It is mandatory to fill up the following attributes MANUFACTURER, DESCRIPTION, MOUSER, AVNET, ARROW, FUTURE, NEWARK, DIGIKEY, AVRG-PRICE, OCTOPART-LINK, DATASHEET; EAGLEUP: SOT95P280X100-5N
IC4 = mchp-power:MCP125*?: Low Noise, Positive-Regulated Charge Pump Description The MCP1252/3 are inductorless, positive-regulated charge pump DC/DC converters. The devices generate a regulated fixed (3.3V or 5.0V) or adjustable output voltage. They are specifically designed for applications requiring low noise and high efficiency and are able to deliver up to 120 mA output current. The devices allow the input voltage to be lower or higher than the output voltage, by automatically switching between buck/ boost operation. The MCP1252 has a switching frequency of 650 kHz, avoiding interference with sensitive IF bands. The MCP1253 has a switching frequency of 1 MHz and allows the use of smaller capacitors than the MCP1252, thus saving board space and cost. FEATURES • Inductorless, Buck/Boost, DC/DC Converter • Low Power: 80 µA (Typical) • High Output Voltage Accuracy: - ±2.5% (VOUT Fixed) • 120 mA Output Current • Wide Operating Temperature Range: - -40°C to +85°C • Thermal Shutdown and Short-Circuit Protection • Uses Small Ceramic Capacitors • Switching Frequency: - MCP1252: 650 kHz - MCP1253: 1 MHz • Low Power Shutdown Mode: 0.1 µA (Typical) • Shutdown Input Compatible with 1.8V Logic • VIN Range: 2.0V to 5.5V • Selectable Output Voltage (3.3V or 5.0V) or Adjustable Output Voltage • Space-saving, 8-Lead MSOP • Soft-Start Circuitry to Minimize In-Rush Current How to order Device Operating Frec. Mode Package MCP125 2 = 650 KHz 3 = 1MHz -33x50 = Fixed -ADJ = Adjustable I/MS = micro small outline package Ref: Datasheet <http://www.mouser.com/ds/2/268/21752a-64146.pdf>; EAGLEUP: SOP65P490X109-8M; MANUFACTURER: MICROCHIP
J1 J2 = wurth-pin-socket-headers:6130231?: (23) 2.54mm Pin Header Description MATERIAL INSULATOR: PBT FLAMABILITY RATING: UL94-V0 COLOR: BLACK CONTACT MATERIAL: COPPER ALLOY CONTACT TYPE: STAMPED CONTACT PLATING: GOLD QUALITY CLASS: 3 AS PER CECC 75 301-802 PITCH: 2.54MM ENVIRONMENTAL OPERATING TEMPERATURE: -40 UP TO 125°C COMPLIANCE: LEAD FREE AND ROHS ELECTRICAL CURRENT RATING: 3A WORKING VOLTAGE: 250V AC INSULATOR RESISTANCE: >1000 MOHM DIELECTRIC WITHSTANDING VOLTAGE: 500V AC/MN CONTACT RESISTANCE: 20 mOHM MAX DIMENSION B = 2.54 x NB POSITIONS How to order Type Header/Socket Number of Positions Variation 613 = 2.54mm Pitch from 1 to 40 1121 = Pin Header Straigh Post 1021 = Pin Header Right Angle 1821 = Socket Header Straigh Post 43121 = Socket Header Right Angle Ref: Datasheet <http://katalog.we-online.de/em/datasheet/6130xx11121.pdf> , Datasheet <http://katalog.we-online.de/em/datasheet/6130xx11021.pdf> , Datasheet <http://katalog.we-online.de/em/datasheet/6130xx11821.pdf> , Datasheet <http://katalog.we-online.de/em/datasheet/6130xx143121.pdf>
J3 = wurth-pin-socket-headers:6130061?: (6) 2.54mm Pin Header Description MATERIAL INSULATOR: PBT FLAMABILITY RATING: UL94-V0 COLOR: BLACK CONTACT MATERIAL: COPPER ALLOY CONTACT TYPE: STAMPED CONTACT PLATING: GOLD QUALITY CLASS: 3 AS PER CECC 75 301-802 PITCH: 2.54MM ENVIRONMENTAL OPERATING TEMPERATURE: -40 UP TO 125°C COMPLIANCE: LEAD FREE AND ROHS ELECTRICAL CURRENT RATING: 3A WORKING VOLTAGE: 250V AC INSULATOR RESISTANCE: >1000 MOHM DIELECTRIC WITHSTANDING VOLTAGE: 500V AC/MN CONTACT RESISTANCE: 20 mOHM MAX DIMENSION B = 2.54 x NB POSITIONS How to order Type Header/Socket Number of Positions Variation 613 = 2.54mm Pitch from 1 to 40 1121 = Pin Header Straigh Post 1021 = Pin Header Right Angle 1821 = Socket Header Straigh Post 43121 = Socket Header Right Angle Ref: Datasheet <http://katalog.we-online.de/em/datasheet/6130xx11121.pdf> , Datasheet <http://katalog.we-online.de/em/datasheet/6130xx11021.pdf> , Datasheet <http://katalog.we-online.de/em/datasheet/6130xx11821.pdf> , Datasheet <http://katalog.we-online.de/em/datasheet/6130xx143121.pdf>; AVRG-PRICE: 0.41; DATASHEET: http://www.mouser.com/ds/2/445/6130xx11121-48870.pdf; DESCRIPTION: pin header straight post 2.54"; EAGLEUP: PHSP254P1524X254X1154-6S; MANUFACTURER: WURTH; MOUSER: 710-61300611121; OCTOPART-LINK: http://octopart.com/61300611121-w%C3%BCrth+elektronik+midcom-20084590
J4 = te-usb:292303-?*: USB A R/A RCPT Description Product Type Features: Size = Standard Series = A Gender = Receptacle Orientation = Right Angle LED = Without PCB Mount Retention Type = Kinked Leg(s) Mechanical Attachment: Mount Location = Top Termination Features: Contact Termination Type = Through Hole Termination Method = Solder Tail Length (mm [in]) = 2.84 [0.112] Dimensions: PCB Thickness, Recommended (mm [in]) = 1.57 [0.062] How to order Common Part Type = Caractericitcs 292303 -1 = Solder tail length 2.84 mm/Kinked legs -2 = Solder tail length 2.29 mm/Kinked legs -4 = Solder tail length 2.84 mm/Kinked legs/High temperature compatible -5 = Solder tail length 2.84 mm/Kinked legs -6 = Solder tail length 2.29 mm/Kinked legs/High temperature compatible -7 = T/H solder legs -9 = High temperature surface mount hold down tab Ref: Datasheet <http://www.te.com/commerce/DocumentDelivery/DDEController?Action=showdoc&DocId=Customer+Drawing%7F292303%7FE8%7Fpdf%7FEnglish%7FENG_CD_292303_E8.pdf%7F292303-1>; EAGLEUP: USB-A-TH+TH
J5 = te-usb:1981584-1: MICRO USB RECEPTACLE STANDARD TYPE AB ASSY Description Product Type Features: Size = Micro Series = AB Gender = Receptacle Orientation = Right Angle LED = Without PCB Mount Retention Type = SMT Hold Down Mechanical Attachment: Mount Location = Top Termination Features: Contact Termination Type = Surface Mount Termination Method = Surface Mount Dimensions: PCB Thickness, Recommended (mm [in]) = 1.00 [0.039] How to order Ref: Datasheet <http://www.te.com/commerce/DocumentDelivery/DDEController?Action=showdoc&DocId=Customer+Drawing%7F1981584%7FD1%7Fpdf%7FEnglish%7FENG_CD_1981584_D1.pdf%7F1981584-1>; EAGLEUP: TE_USB-MICRO-AB-4T
R1-R3 = te-fixed-resistors:CRG?*: Thick Film Chip Resistors 1% and 5% tolerance Description Precious metal terminations are screen printed onto a ceramic base and fired. The resistive element is screen printed and fired and the passivation layer added. Each resistor is trimmed to tolerance by laser. The pre-scribed tile is broken into strips, the end plating is fired on and the strips broken into individual components. Final termination is made by electroplating. Key Features Thick film resistors with a high power to size ratio,ideally suited to industrial and general purpose use. A range from 1 ohm to 10M and tolerances of 1% and 5%. Also including zero ohm links. Suitable for most applications, including high frequency operation, owing to the short lead structure and low capacitance. Seven Package Sizes Terminal finish: Matte Sn MSL Level 2 How to order Common Part Size Tolerance Resistance Value CRG - Thick Film Chip Resistor 0201 0402 0603 0805 1206 2512 F - ±1% J - ±5% 1 ohm (1 ohm) 1R0 1K ohm (1000 ohms) 1K 100K ohm (100000 ohms) 100K 1M ohm (1000000 ohms) 1M Ref: Datasheet <http://www.te.com/commerce/DocumentDelivery/DDEController?Action=showdoc&DocId=Data+Sheet%7F1773204%7FH%7Fpdf%7FEnglish%7FENG_DS_1773204_H.pdf%7F1623095-1>; AVRG-PRICE: 0.1; DATASHEET: http://www.te.com/commerce/DocumentDelivery/DDEController?Action=showdoc&DocId=Data+Sheet%7F1773204%7FH%7Fpdf%7FEnglish%7FENG_DS_1773204_H.pdf%7F1623095-1; DESCRIPTION: Resistores de película gruesa - SMD CRG0603 1% 10K 10KRL; EAGLEUP: RESC0603; MOUSER: 279-CRG0603F10K/10; OCTOPART-LINK: http://octopart.com/crg0603f10k10-tyco+electronics-16077289
R4 R5 = te-fixed-resistors:CRG?*: Thick Film Chip Resistors 1% and 5% tolerance Description Precious metal terminations are screen printed onto a ceramic base and fired. The resistive element is screen printed and fired and the passivation layer added. Each resistor is trimmed to tolerance by laser. The pre-scribed tile is broken into strips, the end plating is fired on and the strips broken into individual components. Final termination is made by electroplating. Key Features Thick film resistors with a high power to size ratio,ideally suited to industrial and general purpose use. A range from 1 ohm to 10M and tolerances of 1% and 5%. Also including zero ohm links. Suitable for most applications, including high frequency operation, owing to the short lead structure and low capacitance. Seven Package Sizes Terminal finish: Matte Sn MSL Level 2 How to order Common Part Size Tolerance Resistance Value CRG - Thick Film Chip Resistor 0201 0402 0603 0805 1206 2512 F - ±1% J - ±5% 1 ohm (1 ohm) 1R0 1K ohm (1000 ohms) 1K 100K ohm (100000 ohms) 100K 1M ohm (1000000 ohms) 1M Ref: Datasheet <http://www.te.com/commerce/DocumentDelivery/DDEController?Action=showdoc&DocId=Data+Sheet%7F1773204%7FH%7Fpdf%7FEnglish%7FENG_DS_1773204_H.pdf%7F1623095-1>; AVRG-PRICE: 0.1; DATASHEET: http://www.te.com/commerce/DocumentDelivery/DDEController?Action=showdoc&DocId=Data+Sheet%7F1773204%7FH%7Fpdf%7FEnglish%7FENG_DS_1773204_H.pdf%7F1623095-1; DESCRIPTION: Resistores de película gruesa - SMD 0603 390Ohms 1/10W 50V; EAGLEUP: RESC0603; MOUSER: 279-CRG0603F390R; OCTOPART-LINK: http://octopart.com/crg0603f390r-tyco+electronics-16077369
R6 = te-fixed-resistors:CRG?*: Thick Film Chip Resistors 1% and 5% tolerance Description Precious metal terminations are screen printed onto a ceramic base and fired. The resistive element is screen printed and fired and the passivation layer added. Each resistor is trimmed to tolerance by laser. The pre-scribed tile is broken into strips, the end plating is fired on and the strips broken into individual components. Final termination is made by electroplating. Key Features Thick film resistors with a high power to size ratio,ideally suited to industrial and general purpose use. A range from 1 ohm to 10M and tolerances of 1% and 5%. Also including zero ohm links. Suitable for most applications, including high frequency operation, owing to the short lead structure and low capacitance. Seven Package Sizes Terminal finish: Matte Sn MSL Level 2 How to order Common Part Size Tolerance Resistance Value CRG - Thick Film Chip Resistor 0201 0402 0603 0805 1206 2512 F - ±1% J - ±5% 1 ohm (1 ohm) 1R0 1K ohm (1000 ohms) 1K 100K ohm (100000 ohms) 100K 1M ohm (1000000 ohms) 1M Ref: Datasheet <http://www.te.com/commerce/DocumentDelivery/DDEController?Action=showdoc&DocId=Data+Sheet%7F1773204%7FH%7Fpdf%7FEnglish%7FENG_DS_1773204_H.pdf%7F1623095-1>; EAGLEUP: RESC0603
SW1 SW2 = esw-tactile-sw:TL3301?*J: 6mm x 6mm Push Button, J lead Description Designed for SMT applications, each model has different features ranging from low profile designs, normally opened, right angle, and dual action. Applications include telecommunications, consumer electronics, audio/visual, medical devices, testing/instrumentation and computer/peripherals. SPECIFICATIONS: RATING: 50mA 12VDC MECHANICAL LIFE: ≥100,000 Cycles CONTACT RESISTANCE: 100mΩ Max. INSULATION RESISTANCE: 100MΩ Min. DIELECTRIC STRENGTH: 250VAC ACTUATION FORCE: 100gf ± 50gf; 160gf± 50gf; 260gf ± 50gf How to order Series Model Actuator Operating Force Contact Material Termination TL 3301 N = 4.3mm A = 5.0mm E = 7.3mm F = 7.0mm C = 8.0mm P = 8.5mm B = 9.5mm D =13.0mm F100 F160 F260 R - Gold Q - Silver J - J-lead Ref: Datasheet <http://www.e-switch.com/Portals/0/Series_Pdf/TL3301.pdf> Add more variants to TL3301@J, just remplace the "@" with a new technologie named according to order code parameters. It is mandatory to fill up the following attributes MANUFACTURER, DESCRIPTION, MOUSER, AVNET, ARROW, FUTURE, NEWARK, DIGIKEY, AVRG-PRICE, OCTOPART-LINK, DATASHEET; AVRG-PRICE: 0.41; DATASHEET: http://www.e-switch.com/Portals/0/Series_Pdf/TL3301.pdf; DESCRIPTION: Interruptores táctiles SMT Tact Switch SPST-NO 0.05A 12V J; DIGIKEY: EG4376TR-ND; EAGLEUP: TACT600X600X430-4J; MANUFACTURER: E-SWITCH; MOUSER: 612-TL3301NF160QJ; NEWARK: 15N4501; OCTOPART-LINK: http://octopart.com/tl3301nf160qj-e-switch-1252925
XT1 = abracon-resonators:AWSCR-*CR-C: 4.5 x 2.0 x 1.2 mm INDUSTRIAL GRADE BUILT-IN CAPACITANCE CERAMIC RESONATOR Description FEATURES: • Low resonant impedance • Built-in load capacitors • IR reflow capable APPLICATIONS: • Remote controls, Microprocessor clocks, DVD & CD-ROMs, Electric appliances • Consumer electronics How to Order Cristal Frequency in MHz Load Capacitance Packaging AWSCR 12.00CR-C Contact ABRACON for Built-in Capacitance options Blank: Bulk T: Tape & Reel Ref: Datasheet <http://www.abracon.com/Resonators/AWSCR_MGD.pdf> Add more variants to AWSCR@, just remplace the "@" with a new technologie named according to order code parameters. It is mandatory to fill it up the following attributes MANUFACTURER, DESCRIPTION, MOUSER, AVNET, ARROW, FUTURE, NEWARK, DIGIKEY, AVRG-PRICE, OCTOPART-LINK, DATASHEET; MANUFACTURER: ABRACON
XT2 = abracon-crystals:ABS07-120-32.768KHZ-T: 3.2 x 1.5 x 0.9mm • Low Profile, 32.768kHz 6pF, ESR Optimized Tuning Fork Crystal Description FEATURES: • Guaranteed ESR of 60kΩ Maximum for Low Power Designs • 0.9mm height ideal for high density circuit boards • Seam sealed ceramic package offers excellent environmental & heat resistance • Extended Operating temperature of -40°C to +85°C for industrial applications APPLICATIONS: • Power sensitive designs requiring Low ESR Crystal • Communication & measurement equipment • Commercial, Consumer & Industrial applications • Wireless communications • PDA and Smartphone How to Order ABS07-120-32.768kHz-T Ref: Datasheet <http://www.abracon.com/Resonators/ABS07-120-32.768kHz-T.pdf> It is mandatory to fill it up the following attributes MANUFACTURER, DESCRIPTION, MOUSER, AVNET, ARROW, FUTURE, NEWARK, DIGIKEY, AVRG-PRICE, OCTOPART-LINK, DATASHEET; EAGLEUP: CEMIC320X150-2N; MANUFACTURER: ABRACON

## Board
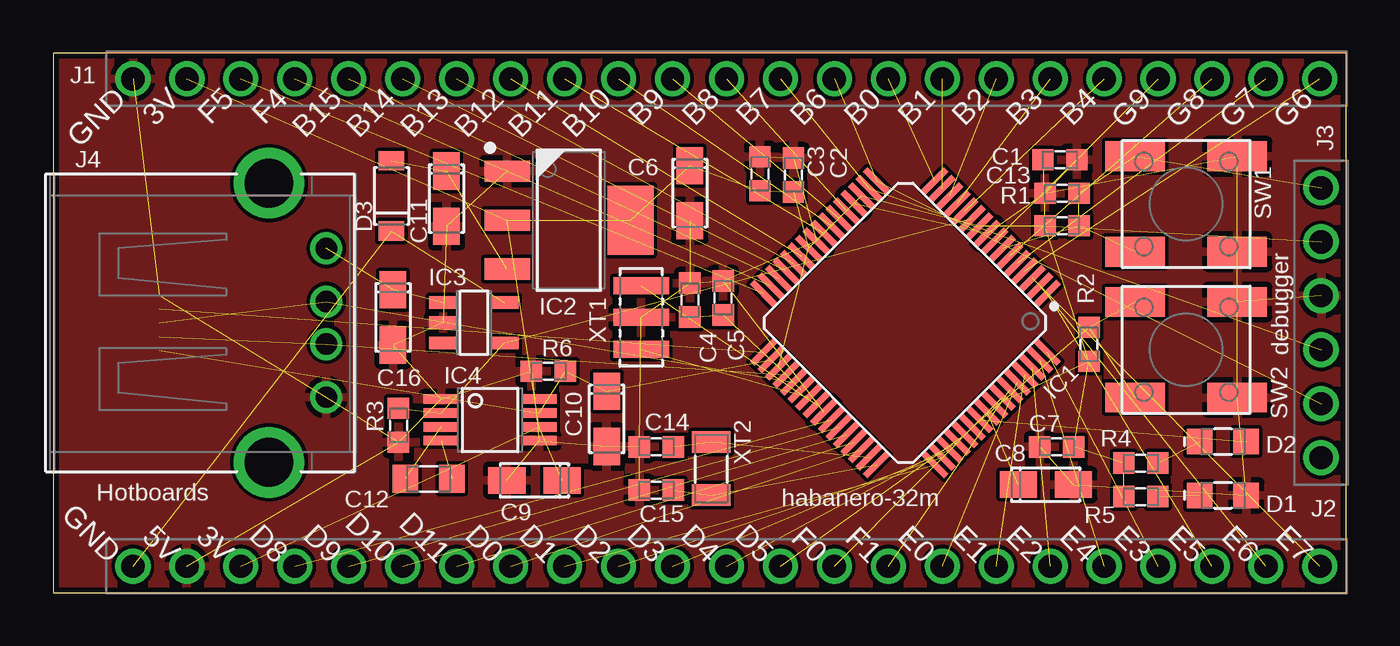
[diagram p1: board, top side]
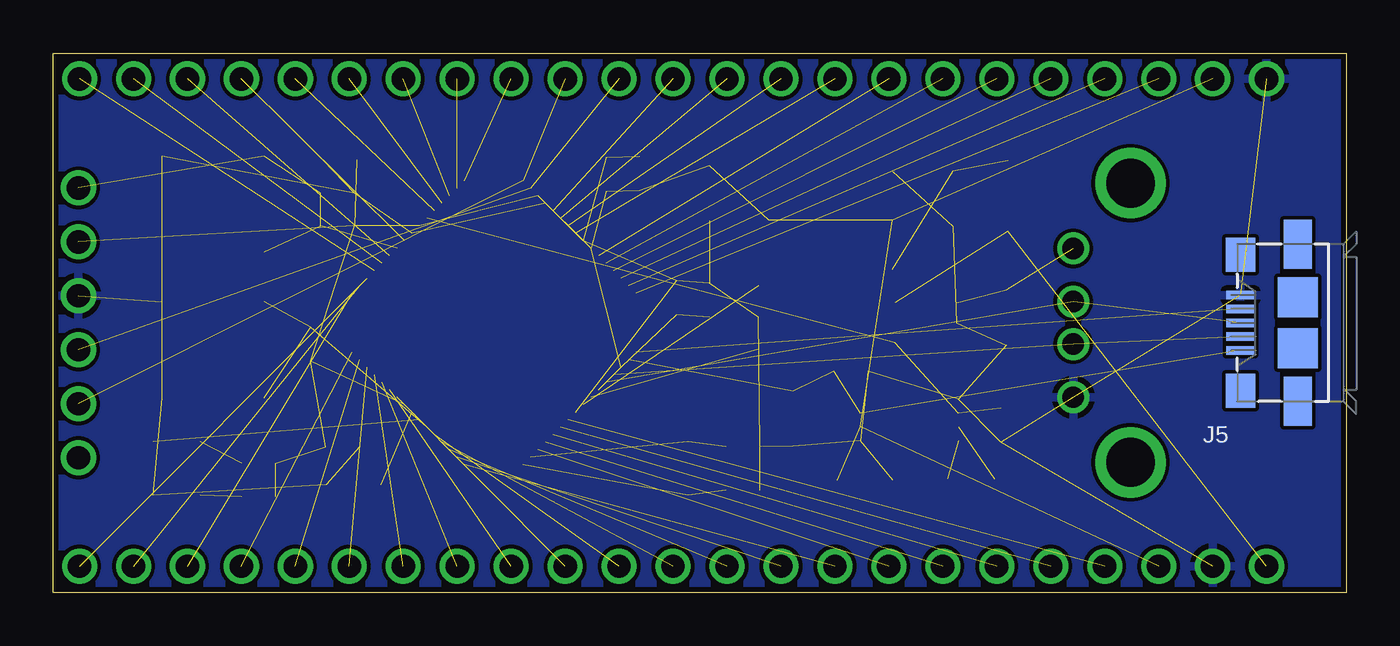
[diagram p2: board, bottom side, seen from below]

Size 60.88 x 25.39 mm. Coordinates in mm from the lower left corner, seen from the top.
Outline: 0,0 60.88,0 60.88,25.39 0,25.39 0,0
Copper layers (1*16): Top 0.035mm / dielectric 1.5mm / Bottom 0.035mm
Design rules "default": minimum track width 8mil, minimum drill 12mil, track to track 7mil, track to pad 7mil, pad to pad 7mil, via to via 7mil, smd to smd 7mil, copper to edge 10mil, drill to drill 8mil, minimum pad ring 10mil, minimum via ring 8mil, stop-mask expansion 4mil, vias tented up to drill 0mil, thermal gap 10mil

### Footprints (pad centres in the part's own frame; a part is rotated, then mirrored left to right if it is on the bottom)
CAPC0603 = smd 1 x 1: 1 0.8,0; 2 -0.8,0
CAPMP3216-18 = smd 1.75 x 1.25: 1 1.3,0; 2 -1.3,0
CAPC0805 = smd 1.2 x 1.3: 1 1.1,0; 2 -1.1,0
D0805 = smd 1.2 x 1.2: 1 1.1,0; 2 -1.1,0
SOT123160X270-2N = smd 0.9 x 1.2: 1 -1.65,0; 2 1.65,0
QFP50P1200X1200X100-64N = smd 1.5 x 0.3: 1 -5.7,3.75; 2 -5.7,3.25; 3 -5.7,2.75; 4 -5.7,2.25; 5 -5.7,1.75; 6 -5.7,1.25; 7 -5.7,0.75; 8 -5.7,0.25; 9 -5.7,-0.25; 10 -5.7,-0.75; 11 -5.7,-1.25; 12 -5.7,-1.75; 13 -5.7,-2.25; 14 -5.7,-2.75; 15 -5.7,-3.25; 16 -5.7,-3.75; 33 5.7,-3.75; 34 5.7,-3.25; 35 5.7,-2.75; 36 5.7,-2.25; 37 5.7,-1.75; 38 5.7,-1.25; 39 5.7,-0.75; 40 5.7,-0.25; 41 5.7,0.25; 42 5.7,0.75; 43 5.7,1.25; 44 5.7,1.75; 45 5.7,2.25; 46 5.7,2.75; 47 5.7,3.25; 48 5.7,3.75 | smd 0.3 x 1.5: 17 -3.75,-5.7; 18 -3.25,-5.7; 19 -2.75,-5.7; 20 -2.25,-5.7; 21 -1.75,-5.7; 22 -1.25,-5.7; 23 -0.75,-5.7; 24 -0.25,-5.7; 25 0.25,-5.7; 26 0.75,-5.7; 27 1.25,-5.7; 28 1.75,-5.7; 29 2.25,-5.7; 30 2.75,-5.7; 31 3.25,-5.7; 32 3.75,-5.7; 49 3.75,5.7; 50 3.25,5.7; 51 2.75,5.7; 52 2.25,5.7; 53 1.75,5.7; 54 1.25,5.7; 55 0.75,5.7; 56 0.25,5.7; 57 -0.25,5.7; 58 -0.75,5.7; 59 -1.25,5.7; 60 -1.75,5.7; 61 -2.25,5.7; 62 -2.75,5.7; 63 -3.25,5.7; 64 -3.75,5.7
SOT230P700X180-4N = smd 2.15 x 1: 1 -2.9,2.3; 2 -2.9,0; 3 -2.9,-2.3 | smd 2.15 x 3.25: 4 2.9,0
SOT95P280X100-5M = smd 1.3 x 0.6: 1 -1.45,0.95; 2 -1.45,0; 3 -1.45,-0.95; 4 1.45,-0.95; 5 1.45,0.95
SOP65P490X109-8M = smd 1.65 x 0.45: 1 -2.3,0.975; 2 -2.3,0.325; 3 -2.3,-0.325; 4 -2.3,-0.975; 5 2.3,-0.975; 6 2.3,-0.325; 7 2.3,0.325; 8 2.3,0.975
PHSP254P5842X254X1154-23S = drill 1.1: 1 0,0; 2 2.54,0; 3 5.08,0; 4 7.62,0; 5 10.16,0; 6 12.7,0; 7 15.24,0; 8 17.78,0; 9 20.32,0; 10 22.86,0; 11 25.4,0; 12 27.94,0; 13 30.48,0; 14 33.02,0; 15 35.56,0; 16 38.1,0; 17 40.64,0; 18 43.18,0; 19 45.72,0; 20 48.26,0; 21 50.8,0; 22 53.34,0; 23 55.88,0
PHSP254P1524X254X1154-6S = drill 1.1: 1 0,0; 2 2.54,0; 3 5.08,0; 4 7.62,0; 5 10.16,0; 6 12.7,0
USB-A = drill 1: 1 2.7,3.5; 2 2.7,1; 3 2.7,-1; 4 2.7,-3.5 | drill 2.3: P$1 0,6.57; P$2 0,-6.57
USB-MICRO-B = smd 1.35 x 0.4: 1 2.7,1.3; 2 2.7,0.65; 3 2.7,0; 4 2.7,-0.65; 5 2.7,-1.3 | smd 1.4 x 1.6: P$1 2.7,3.2; P$2 2.7,-3.2 | smd 1.3 x 2.3: P$3 0,3.7; P$4 0,-3.7 | smd 1.9 x 1.9: P$7 0,-1.2; P$8 0,1.2
RESC0603 = smd 1 x 1: P$1 0.8,0; P$2 -0.8,0
TACT600X600-4J = smd 1.4 x 2.8: 1 -2.25,2.4; 2 2.25,2.4; 3 2.25,-2.4; 4 -2.25,-2.4
CERAMIC460X200-3N = smd 0.8 x 2.6: 1 -1.5,0; 2 0,0; 3 1.5,0
CEMIC320X150-2N = smd 1 x 1.8: 1 -1.25,0; 2 1.25,0

### Placement (x,y rotation side)
C1  47.4,20.37 180 top
C2  34.85,19.66 270 top
C3  33.27,19.71 270 top
C4  29.97,13.77 270 top
C5  31.55,13.87 270 top
C6  29.97,18.8 90 top
C7  47.24,6.86 0 top
C8  46.74,5.08 180 top
C9  22.66,5.28 0 top
C10  26.06,8.18 90 top
C11  18.52,18.54 90 top
C12  17.68,5.36 180 top
C13  47.5,18.8 0 top
C14  28.4,6.86 180 top
C15  28.4,4.83 180 top
C16  16,12.95 90 top
D1  55.07,4.57 180 top
D2  55.07,7.11 180 top
D3  15.93,18.67 90 top
IC1  40.13,12.7 225 top
IC2  24.28,17.53 0 top
IC3  19.81,12.7 0 top
IC4  20.57,8.13 0 top
J1  3.76,24.18 0 top
J2  3.76,1.24 0 top
J3  59.69,19.05 270 top
J4  10.16,12.7 0 top
J5  2.29,12.7 180 bottom
R1  47.5,17.27 0 top
R2  48.77,11.68 90 top
R3  16.26,7.87 270 top
R4  51.21,6.1 0 top
R5  51.21,4.52 0 top
R6  23.32,10.41 180 top
SW1  53.34,18.29 270 top
SW2  53.34,11.43 270 top
XT1  27.69,12.95 270 top
XT2  30.99,5.84 270 top

### Tracks (layer width: path | path; a pad name or v marks a point on that pad's centre or on a via)
+3V3  (23 unrouted)
+5V  (2 unrouted)
B0  (1 unrouted)
B1  (1 unrouted)
B2  (1 unrouted)
B3  (1 unrouted)
B4  (1 unrouted)
B8  (1 unrouted)
B9  (1 unrouted)
B10  (1 unrouted)
B11  (1 unrouted)
B12  (1 unrouted)
B13  (1 unrouted)
B14  (1 unrouted)
B15  (1 unrouted)
BTN  (3 unrouted)
BUSON  (3 unrouted)
D0  (1 unrouted)
D1  (1 unrouted)
D2  (1 unrouted)
D3  (1 unrouted)
D4  (1 unrouted)
D5  (1 unrouted)
D8  (1 unrouted)
D9  (1 unrouted)
D10  (1 unrouted)
D11  (1 unrouted)
D+  (2 unrouted)
D-  (2 unrouted)
E0  (1 unrouted)
E1  (1 unrouted)
E2  (1 unrouted)
E3  (1 unrouted)
E4  (1 unrouted)
E5  (1 unrouted)
E6  (1 unrouted)
E7  (1 unrouted)
EXTAL  (1 unrouted)
F0  (1 unrouted)
F1  (1 unrouted)
F4  (1 unrouted)
F5  (1 unrouted)
G6  (1 unrouted)
G7  (1 unrouted)
G8  (1 unrouted)
G9  (1 unrouted)
GND  (35 unrouted)
  pour Top: 0,25.4 60.96,25.4 60.96,0 0,0
  pour Bottom: 0,25.4 60.96,25.4 60.96,0 0,0
ID  (1 unrouted)
LED  (1 unrouted)
N$6  (2 unrouted)
N$8  (1 unrouted)
N$9  (1 unrouted)
N$10  (1 unrouted)
N$11  (1 unrouted)
N$16  (1 unrouted)
PGC  (2 unrouted)
PGD  (2 unrouted)
RESET  (5 unrouted)
SEXTAL  (2 unrouted)
SXTAL  (2 unrouted)
VBUS  (4 unrouted)
VUSB  (2 unrouted)
XTAL  (1 unrouted)

### Text on the board
tPlace: GND | 3V | F5 | F4 | B15 | B14 | B13 | B12 | B11 | B10 | B9 | B8 | B7 | B6 | B0 | B1 | B2 | B3 | B4 | G9 | G8 | G7 | G6 | debugger | Hotboards | habanero-32m | GND | 5V | 3V | D8 | D9 | D10 | D11 | D0 | D1 | D2 | D3 | D4 | D5 | F0 | F1 | E0 | E1 | E2 | E4 | E3 | E5 | E6 | E7